# Altium schematic sheet MachChoCaAn.SchDoc
size A
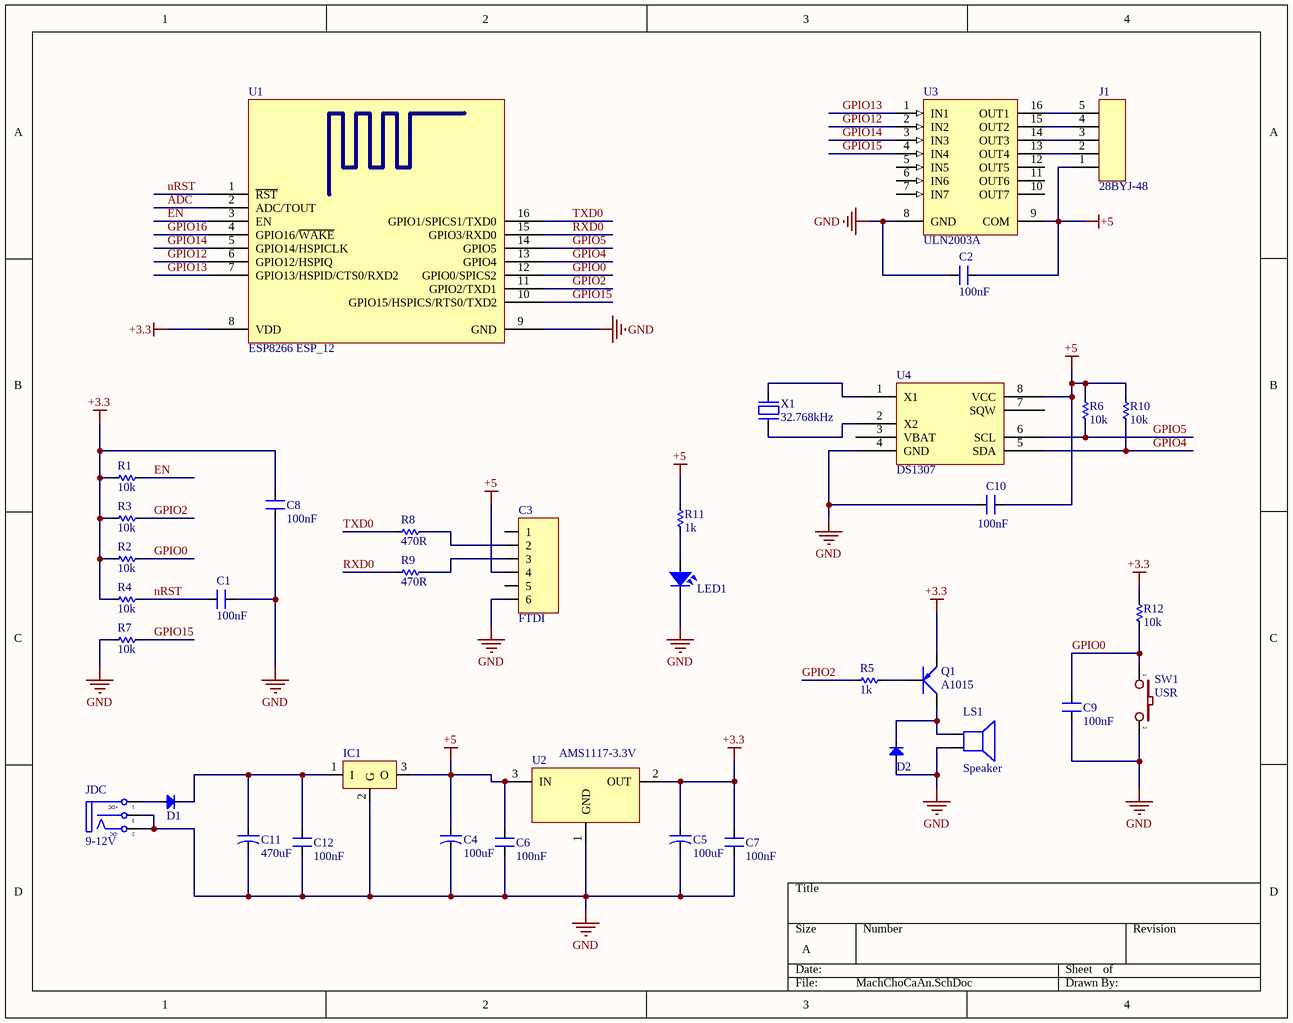
[diagram p0: MachChoCaAn.SchDoc]

## Parts
C1  100nF  [CN-SMD-0805]
C2  100nF  [CN-SMD-0805]
C3  FTDI  [JP6-D1T]
C4  100uF  [CA-ALU-6.3]
C5  100uF  [CA-ALU-6.3]
C6  100nF  [CN-SMD-0805]
C7  100nF  [CN-SMD-0805]
C8  100nF  [CN-SMD-0805]
C9  100nF  [CN-SMD-0805]
C10  100nF  [CN-SMD-0805]
C11  470uF  [CA-ALU-10RL]
C12  100nF  [CN-SMD-0805]
D1  Diode SMD  [DIO-SMD-106]  (value not drawn)
D2  Diode SMD  [DIO-SMD-106]  (value not drawn)
IC1  LM78xx  [TO252-123]  (value not drawn)
J1  28BYJ-48  [XH2.54-5P]
JDC  9-12V  [DC0]
LED1  PWR  [LED-0805-Orange]  (value not drawn)
LS1  Speaker  [SPEAKER]
Q1  A1015  [SOT23B]
R1  10k  [RES-SMD-0805]
R2  10k  [RES-SMD-0805]
R3  10k  [RES-SMD-0805]
R4  10k  [RES-SMD-0805]
R5  1k  [RES-SMD-0805]
R6  10k  [RES-SMD-0805]
R7  10k  [RES-SMD-0805]
R8  470R  [RES-SMD-0805]
R9  470R  [RES-SMD-0805]
R10  10k  [RES-SMD-0805]
R11  1k  [RES-SMD-0805]
R12  10k  [RES-SMD-0805]
SW1  USR  [SW1-DIP]
U1  ESP8266 ESP_12  [ESP8266 ESP_12]
U2  AMS1117-3.3V  [SOT223]
U3  ULN2003A  [SO16]
U4  DS1307  [DS1307]
X1  32.768kHz  [XT32k]

## Nets
+3.3: C5.1 C7.2 C8.2 Q1.3(E) R1.1 R2.1 R3.1 R4.1 R12.2 U1.8(VDD) U2.2(OUT)
+5: C2.2 C3.4 C4.1 C6.2 C10.2 IC1.3(O) J1.1 R6.2 R10.2 R11.1 U2.3(IN) U3.9(COM) U4.8(VCC)
GND: C1.2 C2.1 C3.6 C4.2 C5.2 C6.1 C7.1 C8.1 C9.1 C10.1 C11.2 C12.1 D2.1(A) IC1.2(G) JDC.2(TN) JDC.3(S) LED1.2 LS1.2 R7.1 SW1.2 U1.9(GND) U2.1(GND) U3.8(GND) U4.4(GND)
ADC: U1.2(ADC/TOUT)
EN: R1.2 U1.3(EN)
GPIO0: C9.2 R2.2 R12.1 SW1.1 U1.12(GPIO0/SPICS2)
GPIO2: R3.2 R5.2 U1.11(GPIO2/TXD1)
GPIO4: R10.1 U1.13(GPIO4) U4.5(SDA)
GPIO5: R6.1 U1.14(GPIO5) U4.6(SCL)
GPIO12: U1.6(GPIO12/HSPIQ) U3.2(IN2)
GPIO13: U1.7(GPIO13/HSPID/CTS0/RXD2) U3.1(IN1)
GPIO14: U1.5(GPIO14/HSPICLK) U3.3(IN3)
GPIO15: R7.2 U1.10(GPIO15/HSPICS/RTS0/TXD2) U3.4(IN4)
GPIO16: U1.4(GPIO16/~{WAKE})
nRST: C1.1 R4.2 U1.1(~{RST})
RXD0: R9.1 U1.15(GPIO3/RXD0)
TXD0: R8.1 U1.16(GPIO1/SPICS1/TXD0)
NetC3_2: C3.2 R8.2
NetC3_3: C3.3 R9.2
NetC11_1: C11.1 C12.2 D1.2(K) IC1.1(I)
NetD1_1: D1.1(A) JDC.1(T)
NetD2_2: D2.2(K) LS1.1 Q1.2(C)
NetJ1_2: J1.2 U3.13(OUT4)
NetJ1_3: J1.3 U3.14(OUT3)
NetJ1_4: J1.4 U3.15(OUT2)
NetJ1_5: J1.5 U3.16(OUT1)
NetLED1_1: LED1.1 R11.2
NetQ1_1: Q1.1(B) R5.1
NetU4_1: U4.1(X1) X1.2
NetU4_2: U4.2(X2) X1.1

Not connected (* = marked no-connect by the designer): C3 1 5; U3 5(IN5) 6(IN6) 7(IN7) 10(OUT7) 11(OUT6) 12(OUT5); U4 3(VBAT) 7(SQW)

## Notes on the sheet
- (in symbol DCIN) +DC; -DC

## Library data of the parts
C1 C2 C6-C10 C12 = CN: Value: 33pF
C3 = JP6: WR-PHD 2.54 mm Angled Socket Header; Manufacturer: W¨¹rth Elektronik eiSos GmbH; partNo: 613006143121; ComponentLink1 Description: Manufacturer; ComponentLink2 Description: Datasheet; NoPins: 06; Created Date: 29 March 2013; ComponentLink1URL: http://www.we-online.com; ComponentLink2URL: http://katalog.we-online.de/em/datasheet/6130xx143121.pdf; Created by: Karrer Zheng
C4 C5 C11 = CN-ALU-DIP: Capacitor (Semiconductor SIM Model); Value: 104; LatestRevisionDate: 17-Jul-2002; LatestRevisionNote: Re-released for DXP Platform.; PackageReference: C1206; Publisher: Altium Limited
D1 D2 = Diode SMD: Default Diode; Code - JEDEC: DO-214-AB; Value: 1N5007; Published: 8-Jun-2000; Revision: July-2002: Re-released for DXP Platform.; Publisher: Altium Limited
IC1 = LM78xx: Positive Voltage Regulator; Note: Tab is connected to pin 3 (GND).; Published: 24-Aug-2001; LatestRevisionDate: 17-Jul-2002; LatestRevisionNote: Re-released for DXP Platform.; DatasheetVersion: Apr-1994; PackageVersion: Jul-1998; PackageReference: ISOWATT220AB; Publisher: Altium Limited; PackageDescription: TO, Thru-Hole, Vertical, Heatsink Mounted; 3 In-Line Leads; Pitch 2.54 mm; Pin sequence 1, 3, 2; ComponentLink1Description: Manufacturer Link; ComponentLink1URL: http://www.st.com/; ComponentLink2Description: Datasheet; ComponentLink2URL: http://www.st.com/stonline/products/literature/ds/2146/l78m05c.pdf
J1 = XH2.54-5P
JDC = DCIN: Jac DC input; Value: Jac DC
LED1 = LED SMD: Value: LED 3 - 5 ly 2 Colour
LS1 = Speaker: Loudspeaker; Published: 24-Mar-1999; LatestRevisionDate: 17-Jul-2002; LatestRevisionNote: Re-released for DXP Platform.; PackageReference: PIN2; Publisher: Altium Limited
Q1 = A1015: Dán; Ten_Linh_Kien: A1015 SOT23 TRANS PNP 0.15A 50V ( SMD-BA); Don_Vi: Con; Ma_Hang: MH001957; Ghi_Chu: *; Kieu_Chan: *; Chung_Loai: Dán
R1-R12 = Res-SMD: Resistor; Manufacturer: Generic Components; Class: Passive; Published: 08/06/2000; Publisher: Altium Hobart Technology Centre
SW1 = SW2: Switch button 2 pin; Value: SW chip 2 pin
U1 = ESP8266 ESP_12: ESP8266 ESP-12; IC: ESP8266-EX; Vendor: Ai-thinker; LatestReviewer: Zion Blue; Published: 14-Apr-2015; Publisher: Cynetik Group; LatestRevisionData: 14-Apr-2015; LatestRevisionNote: Include 3D body and Footprint
U2 = LM1117: 800mA Low-Dropout Linear Regulator; Creator: Nguyen Ba Bien; Website: http://group3i.net
U3 = ULN2003A: High-Voltage, High-Current Darlington Array; Published: 13-Oct-2000; LatestRevisionDate: 06-Jun-2005; LatestRevisionNote: Stylized 3D Model Added.; DatasheetVersion: 1998; PackageVersion: 1998; PackageReference: A16; Publisher: Altium Limited; PackageDescription: DIP; 16 Leads; Row Spacing 7.62 mm; Pitch 2.54 mm; Code_JEDEC: MS-001-BB; ComponentLink1Description: Manufacturer Link; ComponentLink1URL: http://www.allegromicro.com/
X1 = XT2: Crystal, 32.768 KHz, -40 to 85 degC, 3.2 x 1.5 x 0.9 mm SMD; Value: 4Mhz